# EAGLE design main_board (EAGLE 8.3.2)
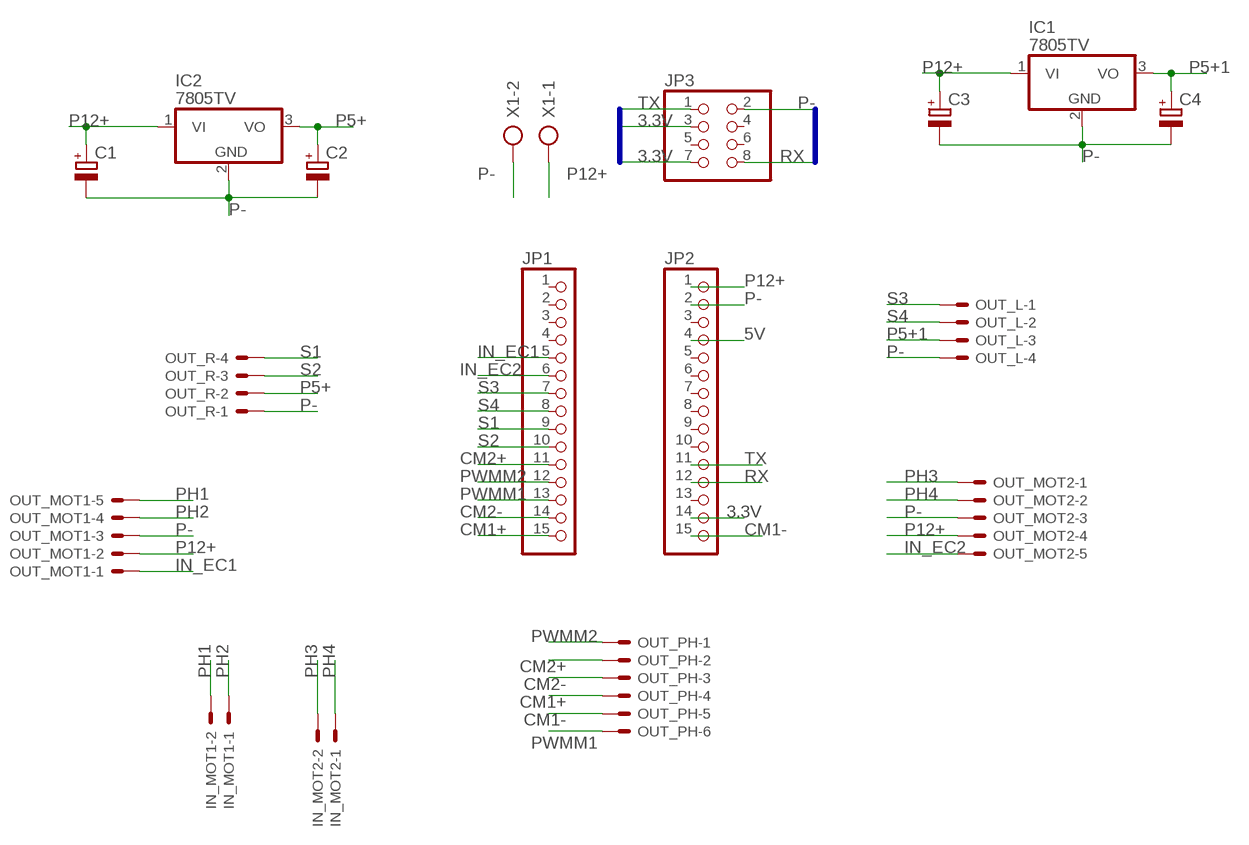
[diagram p0: schematic, sheet 1]

## Parts
C1  CPOL-EUE3.5-10  [E3,5-10]
C2  CPOL-EUE3.5-10  [E3,5-10]
C3  CPOL-EUE3.5-10  [E3,5-10]
C4  CPOL-EUE3.5-10  [E3,5-10]
IC1  7805TV  [TO220V]
IC2  7805TV  [TO220V]
IN_MOT1  22-23-2021  [22-23-2021]
IN_MOT2  22-23-2021  [22-23-2021]
JP1  PINHD-1X15  [1X15]
JP2  PINHD-1X15  [1X15]
JP3  PINHD-2X4  [2X04]
OUT_L  22-23-2041  [22-23-2041]
OUT_MOT1  22-23-2051  [22-23-2051]
OUT_MOT2  22-23-2051  [22-23-2051]
OUT_PH  22-23-2061  [22-23-2061]
OUT_R  22-23-2041  [22-23-2041]
X1  AK300/2  [AK300/2]

## Nets
3.3V: JP2.14 JP3.3 JP3.7
5V: JP2.4
CM1+: JP1.15 OUT_PH.4
CM1-: JP2.15 OUT_PH.5
CM2+: JP1.11 OUT_PH.2
CM2-: JP1.14 OUT_PH.3
IN_EC1: JP1.5 OUT_MOT1.1
IN_EC2: JP1.6 OUT_MOT2.5
P5+: C2.+ IC2.3(VO) OUT_R.2
P5+1: C4.+ IC1.3(VO) OUT_L.3
P12+: C1.+ C3.+ IC1.1(VI) IC2.1(VI) JP2.1 OUT_MOT1.2 OUT_MOT2.4 X1.1
P-: C1.- C2.- C3.- C4.- IC1.2(GND) IC2.2(GND) JP2.2 JP3.2 OUT_L.4 OUT_MOT1.3 OUT_MOT2.3 OUT_R.1 X1.2
PH1: IN_MOT1.2 OUT_MOT1.5
PH2: IN_MOT1.1 OUT_MOT1.4
PH3: IN_MOT2.2 OUT_MOT2.1
PH4: IN_MOT2.1 OUT_MOT2.2
PWMM1: JP1.13 OUT_PH.6
PWMM2: JP1.12 OUT_PH.1
RX: JP2.12 JP3.8
S1: JP1.9 OUT_R.4
S2: JP1.10 OUT_R.3
S3: JP1.7 OUT_L.1
S4: JP1.8 OUT_L.2
TX: JP2.11 JP3.1
Unconnected: JP1.1 JP1.2 JP1.3 JP1.4 JP2.3 JP2.5 JP2.6 JP2.7 JP2.8 JP2.9 JP2.10 JP2.13 JP3.4 JP3.5 JP3.6

## Buses
B1
B2

## Library data of the parts
C1-C4 = rcl:CPOL-EU: POLARIZED CAPACITOR, European symbol
IC1 IC2 = linear:78*: Positive VOLTAGE REGULATOR Source: http://cache.national.com/ds/LM/LM78L05.pdf http://www.fairchildsemi.com/ds/LM/LM7805.pdf
IN_MOT1 IN_MOT2 = con-molex:22-23-2021: .100" (2.54mm) Center Header - 2 Pin; MF: MOLEX; MPN: 22-23-2021; OC_FARNELL: 1462926; OC_NEWARK: 25C3832
JP1 JP2 = pinhead:PINHD-1X15: PIN HEADER
JP3 = pinhead:PINHD-2X4: PIN HEADER
OUT_L OUT_R = con-molex:22-23-2041: .100" (2.54mm) Center Header - 4 Pin; MF: MOLEX; MPN: 22-23-2041; OC_FARNELL: 1462920; OC_NEWARK: 38C0355
OUT_MOT1 OUT_MOT2 = con-molex:22-23-2051: .100" (2.54mm) Center Header - 5 Pin; MF: MOLEX; MPN: 22-23-2051; OC_FARNELL: 1462952; OC_NEWARK: 38C9178
OUT_PH = con-molex:22-23-2061: .100" (2.54mm) Center Header - 6 Pin; MF: MOLEX; MPN: 22-23-2061; OC_FARNELL: 1462922; OC_NEWARK: 27C1933
X1 = con-ptr500:AK300/2: CONNECTOR; OC_FARNELL: unknown; OC_NEWARK: unknown

## Board
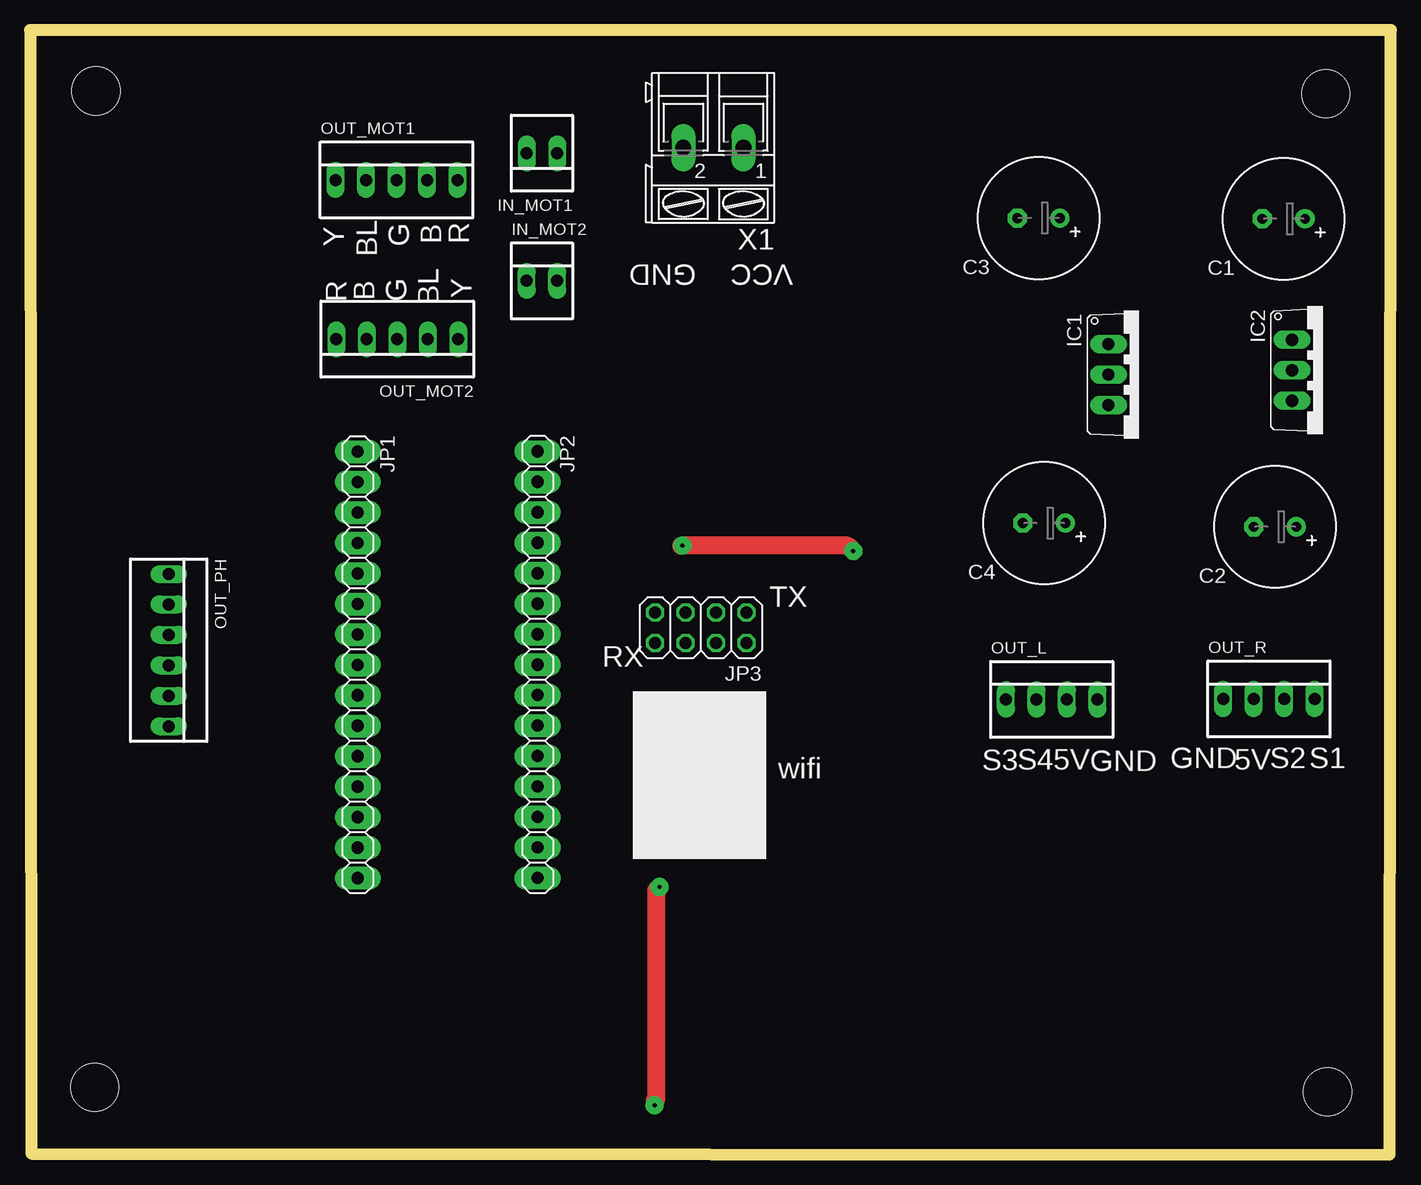
[diagram p1: board, top side]
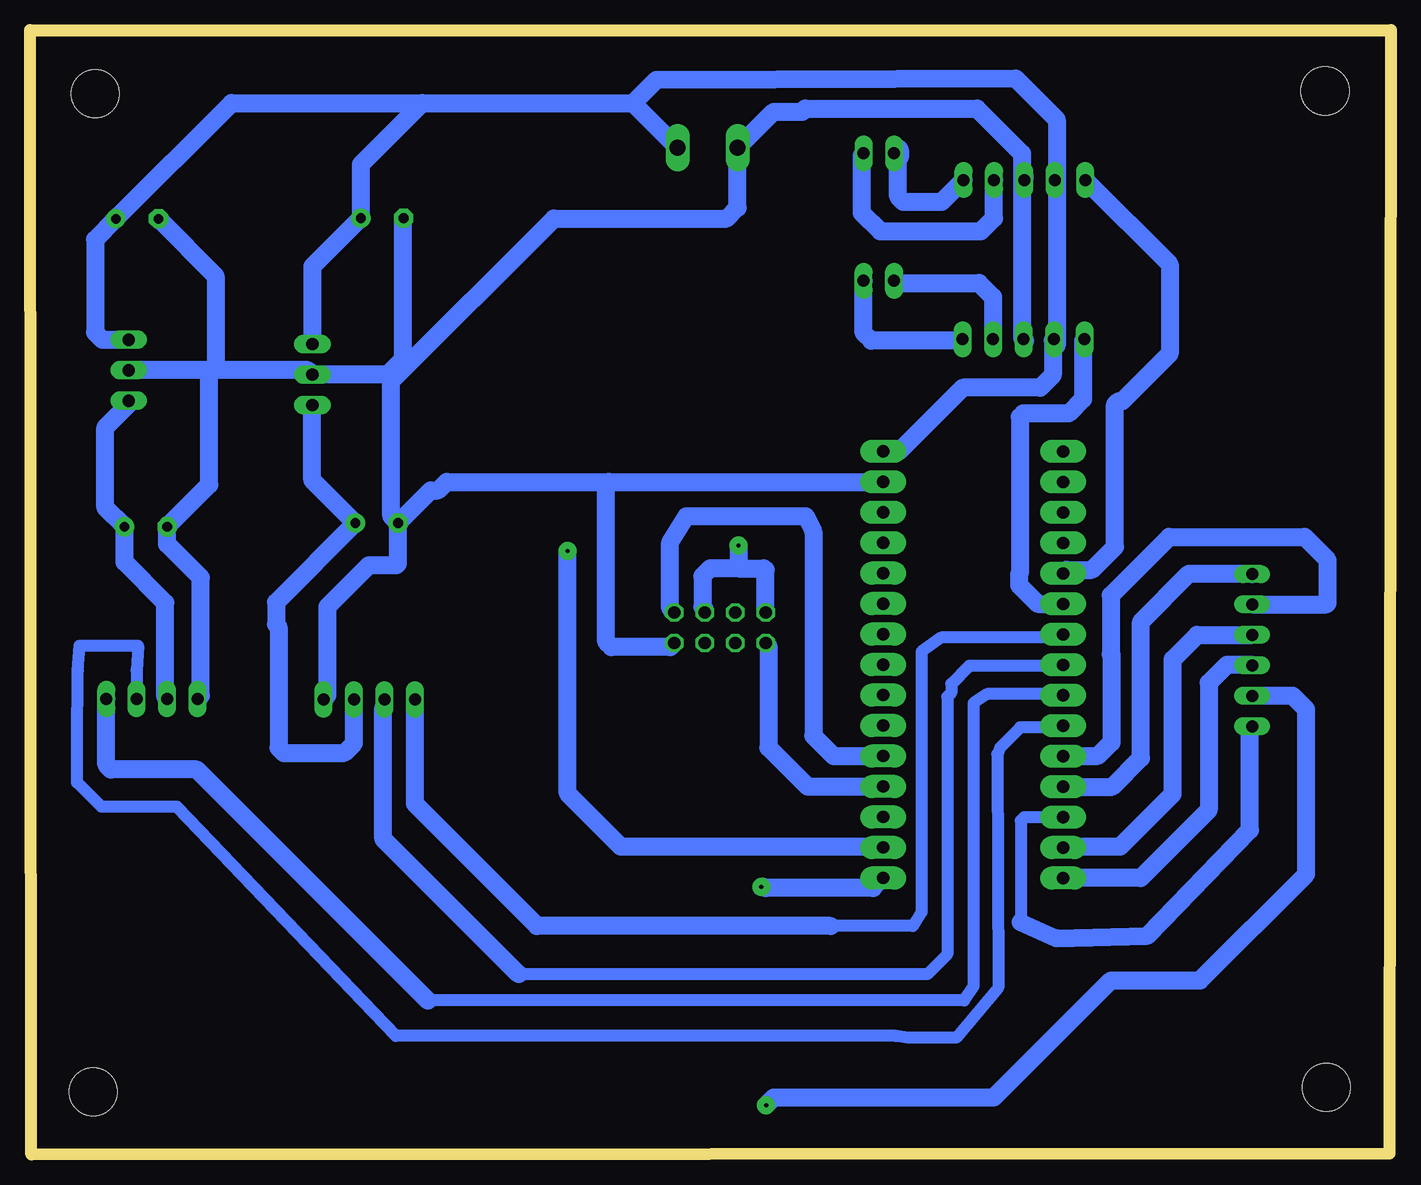
[diagram p2: board, bottom side, seen from below]

Size 113.45 x 93.76 mm. Coordinates in mm from the lower left corner, seen from the top.
Outline: 0.12,0.08 113.34,0 113.45,93.75 0,93.76 0.12,0.08
Copper layers (1*16): Top 0.035mm / dielectric 1.5mm / Bottom 0.035mm
Design rules "default": minimum track width 10mil, minimum drill 24mil, track to track 8mil, track to pad 8mil, pad to pad 8mil, via to via 8mil, smd to smd 8mil, copper to edge 40mil, drill to drill 8mil, minimum pad ring 10mil, minimum via ring 8mil, stop-mask expansion 4mil, vias tented up to drill 0mil, thermal gap 10mil
Holes 4 mm at 5.38,5.61 108.17,5.24 5.49,88.67 108.02,88.45

### Footprints (pad centres in the part's own frame; a part is rotated, then mirrored left to right if it is on the bottom)
E3,5-10 = drill 0.813 pad 1.6: + -1.778,0 | drill 0.813 pad 1.6 octagon: - 1.778,0
TO220V = drill 1.016 long: 1 -2.54,-2.54; 2 0,-2.54; 3 2.54,-2.54
22-23-2021 = drill 1 long: 1 -1.27,0; 2 1.27,0
1X15 = drill 1.016 pad 1.93 long: 1 -17.78,0; 2 -15.24,0; 3 -12.7,0; 4 -10.16,0; 5 -7.62,0; 6 -5.08,0; 7 -2.54,0; 8 0,0; 9 2.54,0; 10 5.08,0; 11 7.62,0; 12 10.16,0; 13 12.7,0; 14 15.24,0; 15 17.78,0
2X04 = drill 1.016 octagon: 1 -3.81,-1.27; 2 -3.81,1.27; 3 -1.27,-1.27; 4 -1.27,1.27; 5 1.27,-1.27; 6 1.27,1.27; 7 3.81,-1.27; 8 3.81,1.27
22-23-2041 = drill 1 long: 1 -3.81,0; 2 -1.27,0; 3 1.27,0; 4 3.81,0
22-23-2051 = drill 1 long: 1 -5.08,0; 2 -2.54,0; 3 0,0; 4 2.54,0; 5 5.08,0
22-23-2061 = drill 1 long: 1 -6.35,0; 2 -3.81,0; 3 -1.27,0; 4 1.27,0; 5 3.81,0; 6 6.35,0
AK300/2 = drill 1.321 long: 1 -2.515,0; 2 2.489,0

### Placement (x,y rotation side)
C1  104.51,78.02 180 top
C2  103.79,52.34 180 top
C3  84.09,78.07 180 top
C4  84.55,52.66 180 top
IC1  92.45,65.03 270 top
IC2  107.75,65.39 270 top
IN_MOT1  42.68,83.48 180 top
IN_MOT2  42.69,72.84 0 top
JP1  27.32,40.83 270 top
JP2  42.31,40.85 270 top
JP3  55.92,43.92 180 top
OUT_L  85.17,37.95 0 top
OUT_MOT1  30.55,81.26 0 top
OUT_MOT2  30.62,67.98 180 top
OUT_PH  11.56,42.05 270 top
OUT_R  103.28,37.99 0 top
X1  56.95,83.94 180 top

### Tracks (layer width: path | path; a pad name or v marks a point on that pad's centre or on a via)
3.3V  (via drill 0.35 pad 1.5)
  Top 1.5: v68.63,50.34 68.19,50.78 v54.38,50.78 54.29,50.78
  Bottom 1.5: JP3.7 52.13,45.22 52.13,48.74 52.26,48.88 54.38,48.88 | 54.38,48.88 56.75,48.88 57.38,48.23 57.38,45.66 57.19,45.47 JP3.3 | JP2.14 42.37,25.66 64.17,25.66 68.63,30.12 v68.63,50.34 | v54.38,50.78 54.38,48.88
CM1+
  Bottom 1.016: OUT_PH.4 11.61,40.84
  Bottom 1.5: 11.61,40.84 13.66,40.84 15.18,39.33 15.18,28.73 20.85,23.05 JP1.15
CM1-  (via drill 0.35 pad 1.5)
  Top 1.5: v52.48,22.31 52.2,22.04 52.2,4.64 52.08,4.51 v52.08,4.12
  Bottom 1.5: JP2.15 43.16,22.22 52.12,22.22 52.22,22.31 v52.48,22.31 | v52.08,4.12 51.44,4.76 33.09,4.76 23.34,14.52 15.9,14.52 7.05,23.38 7.05,37.11 8.18,38.24 OUT_PH.5
CM2+
  Bottom 1.5: 5.26,45.97 5.26,49.57 7.18,51.49 18.48,51.49 23.35,46.61 23.35,41.73 23.3,41.68 23.3,34.35 24.41,33.24 27.3,33.24 JP1.11 | 5.26,45.97 5.37,45.86 | OUT_PH.2 5.37,45.86 | 5.37,45.86 5.26,45.97
CM2-
  Bottom 1.5: JP1.14 27.23,25.68 22.55,25.68 18.17,30.06 18.17,41.28 16.13,43.33 OUT_PH.3
IN_EC1
  Bottom 1.5: OUT_MOT1.1 18.45,74.23 18.45,66.77 22.4,62.81 22.72,62.81 22.99,62.53 22.99,50.67 24.92,48.74 27.03,48.74 JP1.5
IN_EC2
  Bottom 1.5: OUT_MOT2.5 25.66,67.86 25.66,62.98 26.85,61.8 30.63,61.8 30.94,61.49 30.94,48.44 31.01,48.38 31.01,47.48 29.44,45.91 JP1.6
P5+
  Bottom 1.5: IC2.3 105.21,62.58 107.16,60.63 107.16,53.94 C2.+ 105.57,49.4 102.17,46 102.17,38.15 OUT_R.2
P5+1
  Bottom 1.5: IC1.3 89.91,56.24 C4.+ 92.95,46.03 92.95,44.22 92.72,43.99 92.72,33.91 92.29,33.48 92.29,33.45 92.23,33.51 87.22,33.51 86.44,34.29 OUT_L.3
P12+
  Bottom 1.5: IC2.1 107.41,67.93 108.02,68.54 108.02,76.29 C1.+ 96.64,87.66 80.74,87.66 | 63.19,87.66 X1.1 | 80.74,87.66 63.19,87.66 | 80.74,87.66 85.86,82.54 C3.+ 89.91,74.03 IC1.1 | 63.19,87.66 63.18,87.66 61.23,89.61 31.29,89.73 27.85,86.3 27.85,81.11 | 27.85,81.11 OUT_MOT1.2 | 27.85,81.11 27.85,67.46 28.08,67.69 OUT_MOT2.4 28.19,67.88 28.19,64.98 29.23,63.95 35.68,63.95 40.99,58.63 JP2.1
P-
  Bottom 1.5: C1.- 97.97,73.26 97.97,65.44 98.02,65.39 | 98.5,65.39 98.02,65.39 | 98.5,65.39 IC2.2 | 98.02,65.39 90.27,65.39 IC1.2 83.56,65.03 83.34,64.8 | 98.5,65.39 98.5,55.85 C2.- 102.01,50.9 99.21,48.09 99.21,38.25 OUT_R.1 | C4.- 83.34,53.22 83.34,64.48 | 83.34,64.48 83.34,64.8 | C3.- 82.38,78.01 82.38,66.3 83.34,65.34 83.34,64.8 | 83.34,64.48 69.77,78.05 55.34,78.05 54.46,78.93 X1.2 51.46,86.94 49.09,86.94 48.83,87.2 34.49,87.2 30.74,83.45 30.74,81.88 | OUT_L.4 88.64,38.28 88.64,45.69 85.19,49.14 82.89,49.14 82.77,49.27 C4.- | 30.74,81.88 30.74,68.1 OUT_MOT2.3 30.47,67.84 | 30.74,81.88 30.55,81.69 OUT_MOT1.3 | JP3.2 60.07,42.31 64.97,42.31 65.42,42.76 65.42,55.85 65.19,56.09 | 65.19,56.09 JP2.2 | C4.- 80.05,55.38 79.42,55.38 78.71,56.09 65.19,56.09
PH1
  Bottom 1.5: OUT_MOT1.5 37.46,79.42 40.63,79.42 41.08,79.87 41.08,83.94 40.93,83.8 40.93,83.13 41.28,83.48 IN_MOT1.2
PH2
  Bottom 1.5: IN_MOT1.1 44.12,83.31 44.12,78.53 42.56,76.97 34.18,76.97 33.09,78.06 OUT_MOT1.4
PH3
  Bottom 1.5: OUT_MOT2.1 35.84,67.85 43.3,67.85 43.95,68.5 IN_MOT2.2
PH4
  Bottom 1.5: IN_MOT2.1 41.24,72.67 34.33,72.67 33.16,71.5 OUT_MOT2.2
PWMM1
  Bottom 1.016: JP1.13 30.55,28.13 30.84,27.84 30.84,19.38 | 11.75,35.52 OUT_PH.6
  Bottom 1.5: 30.84,19.38 27.89,18.04 20.28,18.26 11.75,27.07 11.75,35.52
PWMM2
  Bottom 1.5: JP1.12 23.23,30.67 20.84,33.06 20.84,44.42 16.82,48.44 11.59,48.44 OUT_PH.1
RX
  Bottom 1.5: JP3.8 51.88,42.43 51.88,33.94 48.63,30.69 JP2.12
S1
  Bottom 1.016: JP1.9 27.42,38.4 33.66,38.4 34.78,37.65 34.78,14.03 35.59,12.85 80.28,12.85
  Bottom 1.5: 80.28,12.85 99.54,32.11 106.7,32.11 107.09,32.5 OUT_R.4
S2
  Bottom 1.016: JP1.10 27.45,35.62 30.88,35.62 32.59,33.91 32.8,33.38 32.73,13.92 36.23,9.76 40.28,9.76 41.28,9.9 82.94,9.9 101.18,28.99 107.48,28.99 109.52,31.02 109.52,34.33 109.46,40.33 109.31,42.44 104.44,42.44 104.55,40.37 OUT_R.3
S3
  Bottom 1.016: JP1.7 27.59,43.1 37.51,43.1 39.12,41.93 39.12,20.23 39.85,19.05 46.7,19.05
  Bottom 1.5: 46.7,19.05 71.17,19.05 81.36,29.24 OUT_L.1
S4
  Bottom 1.016: JP1.8 27.41,40.75 35.16,40.75 36.65,39.25 36.65,38.51 36.98,38.19 36.98,16.7 38.64,15.03 72.72,15.03
  Bottom 1.5: 72.72,15.03 84,26.32 84,37.24 83.9,37.34 OUT_L.2
TX
  Bottom 1.5: JP3.1 60.08,45.54 60.08,51.05 58.73,53.23 48.77,53.23 48.15,51.93 48.15,34.92 46.45,33.23 JP2.11

### Text on the board
tPlace: VCC GND | TX | RX | wifi | S3 | S4 | 5V | GND | GND | 5V | S2 | S1
tOrigins: ENB | IN4 | IN3 | IN2 | IN1 | ENA
tNames: Y | G | B | R | BL | BL | R | B | G | Y